# Altium schematic sheet IO.SchDoc
size A4
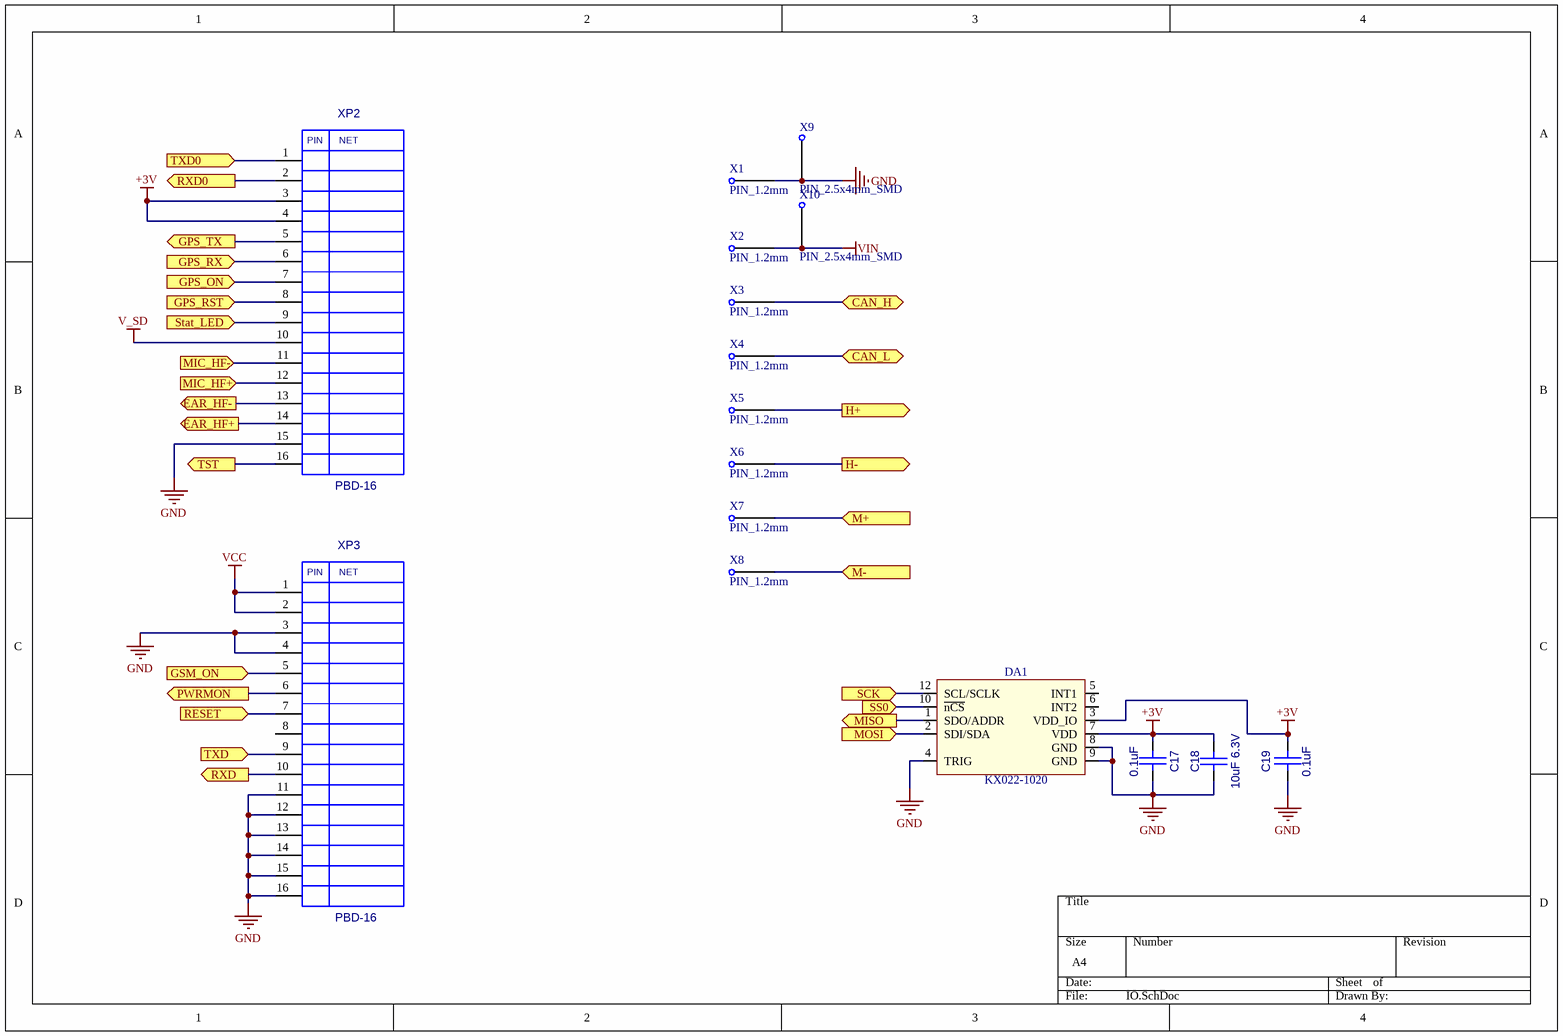
[diagram p0: IO.SchDoc]

## Parts
C17  0.1uF  [CC0603]
C18  10uF 6.3V  [CC0805]
C19  0.1uF  [CC0603]
DA1  KX022-1020  [LGA-12]
X1  PIN_1.2mm  [PIN_1.2mm]
X2  PIN_1.2mm  [PIN_1.2mm]
X3  PIN_1.2mm  [PIN_1.2mm]
X4  PIN_1.2mm  [PIN_1.2mm]
X5  PIN_1.2mm  [PIN_1.2mm]
X6  PIN_1.2mm  [PIN_1.2mm]
X7  PIN_1.2mm  [PIN_1.2mm]
X8  PIN_1.2mm  [PIN_1.2mm]
X9  PIN_2.5x4mm_SMD  [PIN_2.5x4mm_SMD]
X10  PIN_2.5x4mm_SMD  [PIN_2.5x4mm_SMD]
XP2  PBD-16  [PBD16]
XP3  PBD-16  [PBD16]

## Ports
CAN_H (bidir), CAN_L (bidir), EAR_HF+ (out), EAR_HF- (out), GPS_ON (in), GPS_RST (in), GPS_RX (in), GPS_TX (out), GSM_ON (in), H+ (out), H- (out), M+ (in), M- (in), MIC_HF+ (in), MIC_HF- (in), MISO (out), MOSI (in), PWRMON (out), RESET (in), RXD0 (out), RXD (out), SCK (in), SS0 (in), Stat_LED (in), TST (out), TXD0 (in), TXD (in)

## Nets
+3V: C17.1(A) C18.2(B) C19.1(A) DA1.3(VDD_IO) DA1.7(VDD) XP2.3 XP2.4
GND: C17.2(B) C18.1(A) C19.2(B) DA1.4(TRIG) DA1.8(GND) DA1.9(GND) X1.1 X9.1 XP2.15 XP3.3 XP3.4 XP3.11 XP3.12 XP3.13 XP3.14 XP3.15 XP3.16
V_SD: XP2.10
VCC: XP3.1 XP3.2
VIN: X2.1 X10.1
CAN_H: X3.1 ; port CAN_H
CAN_L: X4.1 ; port CAN_L
EAR_HF+: XP2.14 ; port EAR_HF+
EAR_HF-: XP2.13 ; port EAR_HF-
GPS_ON: XP2.7 ; port GPS_ON
GPS_RST: XP2.8 ; port GPS_RST
GPS_RX: XP2.6 ; port GPS_RX
GPS_TX: XP2.5 ; port GPS_TX
GSM_ON: XP3.5 ; port GSM_ON
H+: X5.1 ; port H+
H-: X6.1 ; port H-
M+: X7.1 ; port M+
M-: X8.1 ; port M-
MIC_HF+: XP2.12 ; port MIC_HF+
MIC_HF-: XP2.11 ; port MIC_HF-
MISO: DA1.1(SDO/ADDR) ; port MISO
MOSI: DA1.2(SDI/SDA) ; port MOSI
PWRMON: XP3.6 ; port PWRMON
RESET: XP3.7 ; port RESET
RXD: XP3.10 ; port RXD
RXD0: XP2.2 ; port RXD0
SCK: DA1.12(SCL/SCLK) ; port SCK
SS0: DA1.10(~{nCS}) ; port SS0
Stat_LED: XP2.9 ; port Stat_LED
TST: XP2.16 ; port TST
TXD: XP3.9 ; port TXD
TXD0: XP2.1 ; port TXD0

Not connected (* = marked no-connect by the designer): DA1 5(INT1) 6(INT2); XP3 8

## Notes on the sheet
- (in symbol PBD-16) PIN; NET

## Library data of the parts
C17 C19 = CC0603: Value: 0.1uF
C18 = CC0805: Value: 10uF 6.3V
DA1 = KX022-1020: Value: KX022-1020
XP2 XP3 = PBD-16: Value: *